# Altium schematic sheet nrf52833_cjaa_var1.SchDoc: nRF52833-CJAA Ref. Layout (LDO only, VBUS supply)
size A4; Revision: 1.1; SheetNumber: 1; SheetTotal: 1; DrawnBy: RUBR; DocumentSize: A4; BoardTitle: nRF52833-CJAA Ref. Layout (LDO only, VBUS supply)
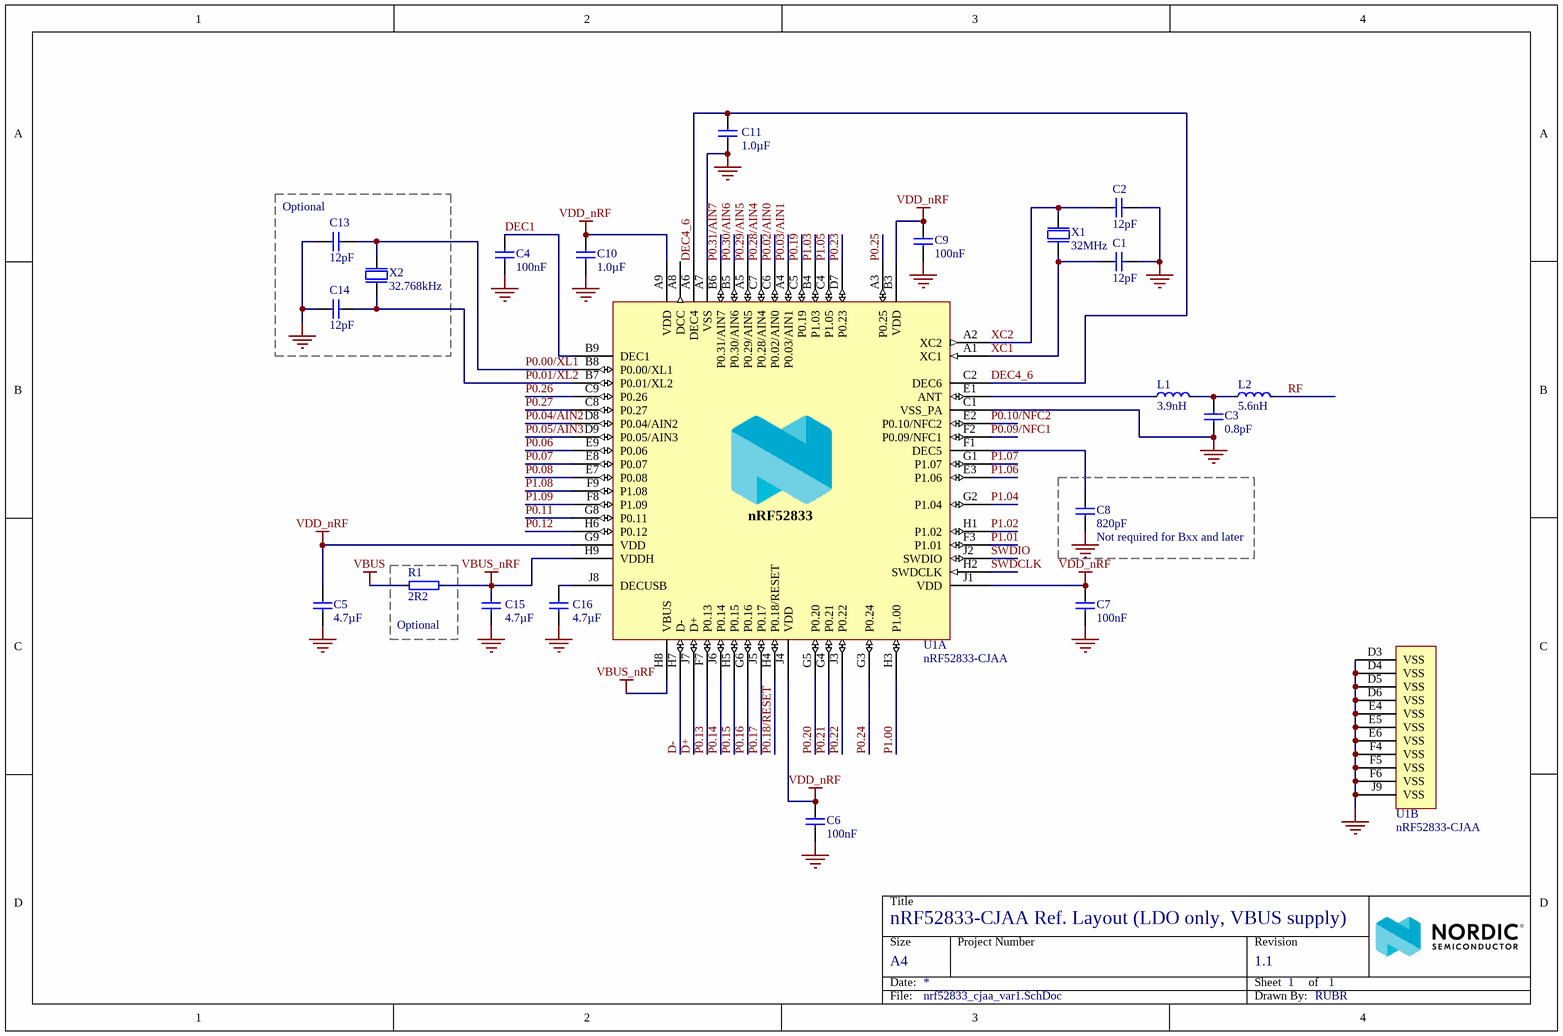
[diagram p0: nrf52833_cjaa_var1.SchDoc]

## Parts
C1  12pF  [CAPC0603X03L_C]
C2  12pF  [CAPC0603X03L_C]
C3  0.8pF  [CAPC0603X03L_C]
C4  100nF  [CAPC0603X03L_C]
C5  4.7µF  [CAPC1608X06L]
C6  100nF  [CAPC0603X03L_C]
C7  100nF  [CAPC0603X03L_C]
C8  820pF  Assembly: Not required for Bxx and later  [CAPC0603X03L_C]
C9  100nF  [CAPC0603X03L_C]
C10  1.0µF  [CAPC1608X06L]
C11  1.0µF  [CAPC1608X06L]
C13  12pF  [CAPC0603X03L_C]
C14  12pF  [CAPC0603X03L_C]
C15  4.7µF  [CAPC1608X06L]
C16  4.7µF  [CAPC1608X06L]
L1  3.9nH  [INDC0603X03L_C]
L2  5.6nH  [INDC0603X03L_C]
R1  2R2  [RESC0603X03L_C]
U1  nRF52833-CJAA  [BGA75C35P10X10_318X318X50]  (parts A,B of 2)
X1  32MHz  [BT-XTAL_1612]
X2  32.768kHz  [XTAL_2012]

## Blocks framed on the sheet
Optional: C13 C14 X2
Optional: R1

## Nets
GND: C1.2 C2.2 C3.1 C4.2 C5.2 C6.2 C7.2 C8.2 C9.2 C10.2 C11.1 C13.2 C14.2 C15.2 C16.2 U1.A7(VSS) U1.C1(VSS_PA) U1.D3(VSS) U1.D4(VSS) U1.D5(VSS) U1.D6(VSS) U1.E4(VSS) U1.E5(VSS) U1.E6(VSS) U1.F4(VSS) U1.F5(VSS) U1.F6(VSS) U1.J9(VSS) X1.2(GND) X1.4(GND)
VBUS: R1.1
VBUS_nRF: C15.1 R1.2 U1.H8(VBUS) U1.H9(VDDH)
VDD_nRF: C5.1 C6.1 C7.1 C9.1 C10.1 U1.A9(VDD) U1.B3(VDD) U1.G9(VDD) U1.J1(VDD) U1.J4(VDD)
D+: U1.J7(D+)
D-: U1.H7(D-)
DEC1: C4.1 U1.B9(DEC1)
DEC4_6: C11.2 U1.A6(DEC4) U1.C2(DEC6)
P0.00/XL1: C13.1 U1.B8(P0.00/XL1) X2.1(inp)
P0.01/XL2: C14.1 U1.B7(P0.01/XL2) X2.2(out)
P0.02/AIN0: U1.C6(P0.02/AIN0)
P0.03/AIN1: U1.A4(P0.03/AIN1)
P0.04/AIN2: U1.D8(P0.04/AIN2)
P0.05/AIN3: U1.D9(P0.05/AIN3)
P0.06: U1.E9(P0.06)
P0.07: U1.E8(P0.07)
P0.08: U1.E7(P0.08)
P0.09/NFC1: U1.F2(P0.09/NFC1)
P0.10/NFC2: U1.E2(P0.10/NFC2)
P0.11: U1.G8(P0.11)
P0.12: U1.H6(P0.12)
P0.13: U1.F7(P0.13)
P0.14: U1.J6(P0.14)
P0.15: U1.H5(P0.15)
P0.16: U1.G6(P0.16)
P0.17: U1.J5(P0.17)
P0.18/RESET: U1.H4(P0.18/RESET)
P0.19: U1.C5(P0.19)
P0.20: U1.G5(P0.20)
P0.21: U1.G4(P0.21)
P0.22: U1.J3(P0.22)
P0.23: U1.D7(P0.23)
P0.24: U1.G3(P0.24)
P0.25: U1.A3(P0.25)
P0.26: U1.C9(P0.26)
P0.27: U1.C8(P0.27)
P0.28/AIN4: U1.C7(P0.28/AIN4)
P0.29/AIN5: U1.A5(P0.29/AIN5)
P0.30/AIN6: U1.B5(P0.30/AIN6)
P0.31/AIN7: U1.B6(P0.31/AIN7)
P1.00: U1.H3(P1.00)
P1.01: U1.F3(P1.01)
P1.02: U1.H1(P1.02)
P1.03: U1.B4(P1.03)
P1.04: U1.G2(P1.04)
P1.05: U1.C4(P1.05)
P1.06: U1.E3(P1.06)
P1.07: U1.G1(P1.07)
P1.08: U1.F9(P1.08)
P1.09: U1.F8(P1.09)
RF: L2.2
SWDCLK: U1.H2(SWDCLK)
SWDIO: U1.J2(SWDIO)
XC1: C1.1 U1.A1(XC1) X1.1(inp)
XC2: C2.1 U1.A2(XC2) X1.3(out)
NetC3_2: C3.2 L1.2 L2.1
NetC8_1: C8.1 U1.F1(DEC5)
NetC16_1: C16.1 U1.J8(DECUSB)
NetL1_1: L1.1 U1.E1(ANT)

Not connected (* = marked no-connect by the designer): U1 A8(DCC)

## Notes on the sheet
- Title
- Size
- Date:
- A4
- Project Number
- Sheet         of
- Revision
- File:
- Drawn By:
- (in symbol nRF52833-CJAA, part A) nRF52833

## Library data of the parts
C1 C2 C13 C14 = C0201-12p: Capacitor, NP0, ±2%; Part Number: C0201-12p; LatestRevisionDate: 2017-11-09; Pin Count: 2; Publisher: Nordic Semiconductor; Published: 2014-11-13; Value: 12pF; Footprint Doc: 0201
C3 = C0201-0.8p: Capacitor, NP0, ±5%; Part Number: C0201-0.8p; LatestRevisionDate: 2018-10-22; Pin Count: 2; Publisher: Nordic Semiconductor; Published: 2014-11-13; Value: 0.8pF; Footprint Doc: 0201
C4 C6 C7 C9 = C0201-100n: Capacitor, X7S, ±10%; Part Number: C0201-100n; LatestRevisionDate: 2017-11-09; Pin Count: 2; Publisher: Nordic Semiconductor; Published: 2014-11-13; Value: 100nF; Footprint Doc: 0201
C5 C16 = C0603-4µ7-6.3V-X7R: Capacitor, X7R, ±10%; Part Number: C0603-4µ7-6.3V-X7R; LatestRevisionDate: 2015-06-10; Pin Count: 2; Publisher: Nordic Semiconductor; Published: 2015-06-10; Value: 4.7µF; Footprint Doc: 0603
C8 = C0201-820p: Capacitor, X7R, ±10%; Part Number: C0201-820p; LatestRevisionDate: 2017-11-09; Pin Count: 2; Publisher: Nordic Semiconductor; Published: 2014-11-13; Value: 820pF; Footprint Doc: 0201
C10 C11 = C0603-1µ0: Capacitor, X7R, ±10%; Part Number: C0603-1µ0; LatestRevisionDate: 2013-06-05; Pin Count: 2; Publisher: Nordic Semiconductor; Published: 2009-05-08; Value: 1.0µF; Footprint Doc: 0603
C15 = C0603-4µ7-10V-X7S: Capacitor, X7S, ±10%; Part Number: C0603-4µ7-10V-X7S; LatestRevisionDate: 2016-08-15; Pin Count: 2; Publisher: Nordic Semiconductor; Published: 2016-08-15; Value: 4.7µF; Footprint Doc: 0603
L1 = L0201-3n9: High frequency chip inductor ±5%; Part Number: L0201-3n9; LatestRevisionDate: 2017-11-09; Pin Count: 2; Publisher: Nordic Semiconductor; Published: 2013-04-10; Value: 3.9nH; Footprint Doc: 0201
L2 = L0201-5n6: High frequency chip inductor ±5%; Part Number: L0201-5n6; LatestRevisionDate: 2013-04-10; Pin Count: 2; Publisher: Nordic Semiconductor; Published: 2013-04-10; Value: 5.6nH; Footprint Doc: 0201
R1 = R0201-2R2: Resistor, ±1%, 0.05W; Part Number: R0201-2R2; Footprint Doc: 0201; LatestRevisionDate: 2014-11-13; Published: 2014-11-13; Value: 2R2; Pin Count: 2; Publisher: Nordic Semiconductor
U1 = nRF52833-CJAA: Multi-protocol Bluetooth Low Energy, IEEE 802.15.4, ANT and 2.4GHz proprietary system-on-chip; Part Number: nRF52833-CJAA; LatestRevisionDate: 2019-12-19; Pin Count: 75; Publisher: Nordic Semiconductor; Published: 2019-02-08; Value: nRF52833-CJAA; Footprint Doc: WLCSP-75
X1 = XTAL_SMD1612_32MHz_8pF_General: XTAL SMD 1612, 32MHz, Cl=8pF, Total Tol: ±40ppm; Part Number: XTAL_SMD1612_32MHz_8pF_General; LatestRevisionDate: 2016-08-19; Pin Count: 4; Publisher: Nordic Semiconductor; Published: 2016-08-19; Value: 32MHz; Footprint Doc: XTAL_1612
X2 = XTAL_SMD2012_32.768kHz_9pF_General: XTAL SMD 2012, 32.768kHz, Cl=9pF, Total Tol: ±50ppm; Part Number: XTAL_SMD2012_32.768kHz_9pF_General; LatestRevisionDate: 2017-01-11; Pin Count: 2; Publisher: Nordic Semiconductor; Published: 2016-08-19; Value: 32.768kHz; Footprint Doc: XTAL_2012